# Altium schematic sheet 电源.SchDoc
size 152 x 127 mm
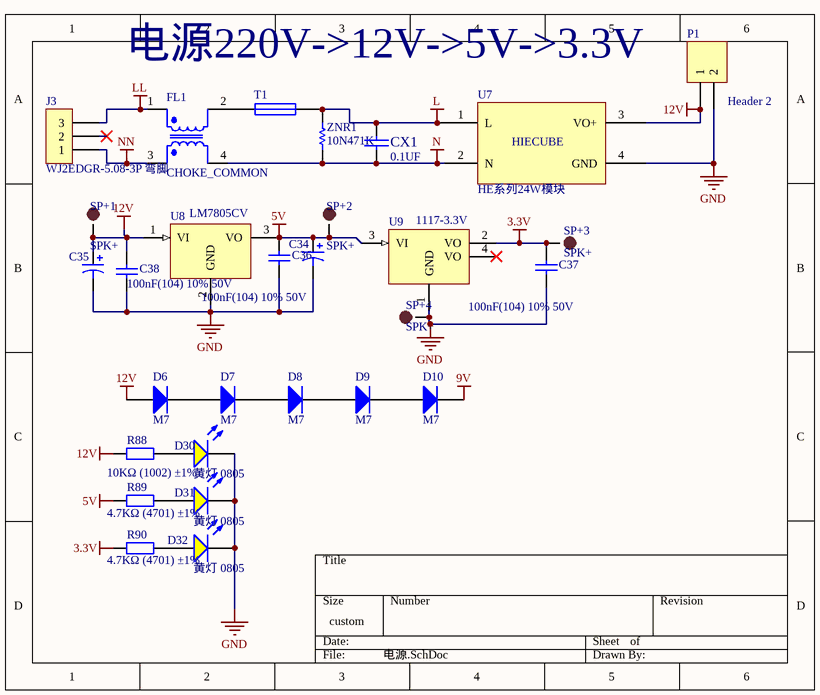
[diagram p0: 电源.SchDoc]

## Parts
C34  Cap Pol1  [CAP1000UF]  (value not drawn)
C35  Cap Pol1  [CAP1000UF]  (value not drawn)
C36  100nF(104) 10% 50V  [0805_C]
C37  100nF(104) 10% 50V  [0805_C]
C38  100nF(104) 10% 50V  [0805_C]
CX1  0.1UF  [0.1uf 安规]
D6  M7  [SMA(DO-214AC)_S1]
D7  M7  [SMA(DO-214AC)_S1]
D8  M7  [SMA(DO-214AC)_S1]
D9  M7  [SMA(DO-214AC)_S1]
D10  M7  [SMA(DO-214AC)_S1]
D30  黄灯 0805  [0805_LED_S1]
D31  黄灯 0805  [0805_LED_S1]
D32  黄灯 0805  [0805_LED_S1]
FL1  CHOKE_COMMON  [CHOKE-13x10]
J3  WJ2EDGR-5.08-3P 弯脚  [WJ2EDGR-5.08-3]
P1  Header 2  [WJ2EDGR-5.08-2]
R88  10KΩ (1002) ±1%  [0805_R]
R89  4.7KΩ (4701) ±1%  [0805_R]
R90  4.7KΩ (4701) ±1%  [0805_R]
SP+1  SPK+  [TP-1.5]
SP+2  SPK+  [TP-1.5]
SP+3  SPK+  [TP-1.5]
SP+4  SPK+  [TP-1.5]
T1  Fuse 1  [392保险丝]  (value not drawn)
U7  HE系列24W模块  [ac转dc]
U8  LM7805CV  [TO-220散热片]
U9  1117-3.3V  [SOT-223]
ZNR1  10N471K  [10N471K]

## Nets
3.3V: C37.2 R90.1 SP+3.1 U9.2(VO)
5V: C34.1 C36.2 R89.1 SP+2.1 U8.3(VO) U9.3(VI)
9V: D10.2(K)
12V: C35.1 C38.2 D6.1(A) P1.1 R88.1 SP+1.1 U7.3(VO+) U8.1(VI)
GND: C34.2 C35.2 C36.1 C37.1 C38.1 D30.K D31.K D32.K P1.2 SP+4.1 U7.4(GND) U8.2(GND) U9.1(GND)
L: CX1.2 T1.2 U7.1(L) ZNR1.1
LL: FL1.1 J3.3
N: CX1.1 FL1.4 U7.2(N) ZNR1.2
NN: FL1.3 J3.1
NetD6_2: D6.2(K) D7.1(A)
NetD7_2: D7.2(K) D8.1(A)
NetD8_2: D8.2(K) D9.1(A)
NetD9_2: D9.2(K) D10.1(A)
NetD30_A: D30.A R88.2
NetD31_A: D31.A R89.2
NetD32_A: D32.A R90.2
NetFL1_2: FL1.2 T1.1

Not connected (* = marked no-connect by the designer): J3 2*; U9 4(VO)*

## Notes on the sheet
- 电源220V->12V->5V->3.3V
- (in symbol HE系列24W模块) HIECUBE

## Library data of the parts
C34 C35 = Cap Pol1: Polarized Capacitor (Radial); Value: 100pF; Published: 8-Jun-2000; LatestRevisionDate: 17-Jul-2002; LatestRevisionNote: Re-released for DXP Platform.; PackageReference: RB7.6-15; Publisher: Altium Limited; PackageDescription: Polarized Capacitor (Radial); 2 Leads
C36-C38 = 0805 100nF(104) 10% 50V: 贴片电容; ComponentLink1Description: 供应商链接; ComponentLink1URL: http://www.szlcsc.com/product/details_50686.html; Package: 0805; Supplier: LC; SuppliersPartNumber: C49678
CX1 = CAP: Capacitor
D6-D10 = SMA(DO-214AC) M7: 二极管; 备注: 1N4007 4007 编号C2464 已经停售, 使用新物料编号C95872; ComponentLink1Description: 供应商链接; ComponentLink1URL: http://www.szlcsc.com/product/details_2841.html; Package: SMA(DO-214AC); Supplier: LC; SuppliersPartNumber: C95872
D30-D32 = 0805 黄灯: 发光二极管; ComponentLink1Description: 供应商链接; ComponentLink1URL: http://www.szlcsc.com/product/details_2669.html; Package: 0805; Supplier: LC; SuppliersPartNumber: C2296
FL1 = CHOKE_COMMON: Choke
J3 = WJ2EDGR-5.08-3P 弯脚: 2EDG连接器; ComponentLink1URL: https://detail.tmall.com/item.htm?spm=a1z10.5-b.w4011-14865958799.85.B0p41N&id=45355509244&rn=e90e7252b5175cd006380c5c01151190&abbucket=9; price: 0.42; Supplier: Farpu; SuppliersPartNumber: *; Manufacturer: *; ComponentLink1Description: 供应商链接
P1 = Header 2: Header, 2-Pin; LatestRevisionDate: 17-Jul-2002; LatestRevisionNote: Re-released for DXP Platform.; Publisher: Altium Limited
R88 = 0805 10KΩ (1002) 1%: 贴片电阻; ComponentLink1Description: 供应商链接; ComponentLink1URL: http://www.szlcsc.com/product/details_18102.html; Package: 0805; Supplier: LC; SuppliersPartNumber: C17414
R89 R90 = 0805 4.7KΩ (4701) 1%: 贴片电阻; ComponentLink1Description: 供应商链接; ComponentLink1URL: http://www.szlcsc.com/product/details_18361.html; Package: 0805; Supplier: LC; SuppliersPartNumber: C17673
SP+1-SP+4 = TEST-POINT: 测试点
T1 = Fuse 1: Fuse; Published: 8-Jun-2000; LatestRevisionDate: 17-Jul-2002; LatestRevisionNote: Re-released for DXP Platform.; PackageReference: PIN-W2/E2.8; Publisher: Altium Limited; PackageDescription: Thru-Hole; 2 Leads
U8 = 78xx: Linear Regulator
U9 = 1117: Linear Regulator
ZNR1 = Res1: Resistor; Value: 1K; Published: 8-Jun-2000; LatestRevisionDate: 17-Jul-2002; LatestRevisionNote: Re-released for DXP Platform.; PackageReference: AXIAL-0.3; Publisher: Altium Limited; PackageDescription: Axial Device, Thru-Hole; 2 Leads; 0.3 in Pin Spacing